# Altium schematic sheet ECUs.SchDoc
size A4; SheetNumber: 2; SheetTotal: 5
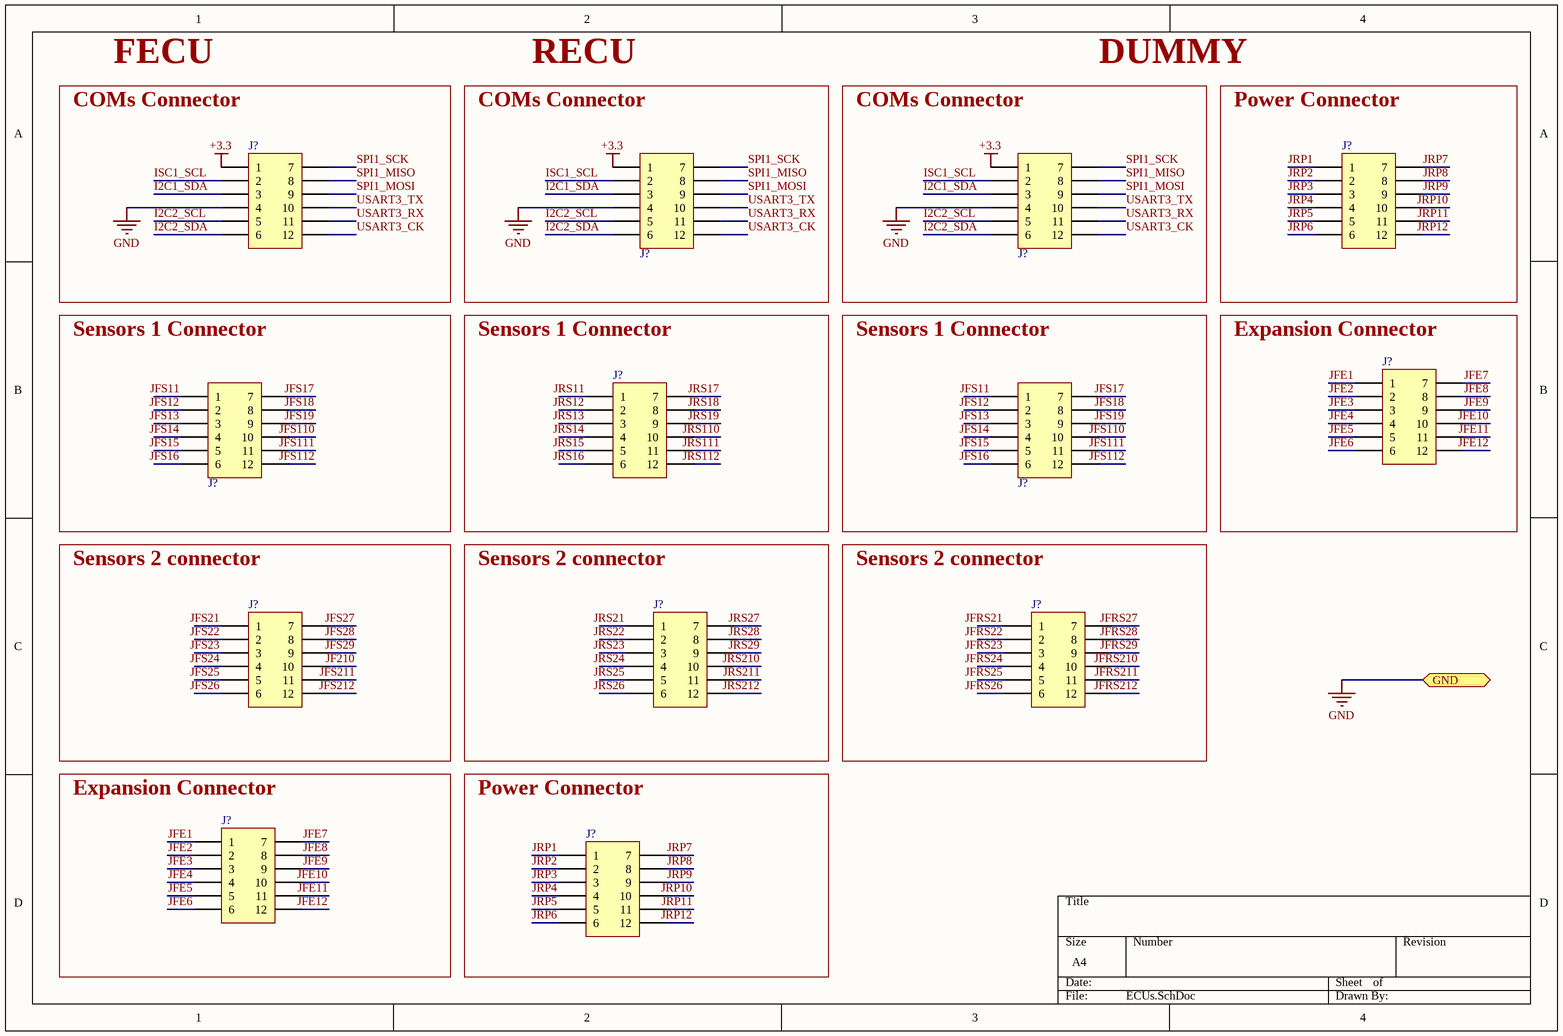
[diagram p0: ECUs.SchDoc]

## Parts
(Parts that share a designator on the sheet are numbered #1, #2 ... from top to bottom, then left to right.)
J?#1  1053101112  [J_NanoFit_2x6_V]  (value not drawn)
J?#2  1053101112  [J_NanoFit_2x6_V]  (value not drawn)
J?#3  1053101112  [J_NanoFit_2x6_V]  (value not drawn)
J?#4  1053101112  [J_NanoFit_2x6_V]  (value not drawn)
J?#5  1053101112  [J_NanoFit_2x6_V]  (value not drawn)
J?#6  1053101112  [J_NanoFit_2x6_V]  (value not drawn)
J?#7  1053101112  [J_NanoFit_2x6_V]  (value not drawn)
J?#8  1053101112  [J_NanoFit_2x6_V]  (value not drawn)
J?#9  1053101112  [J_NanoFit_2x6_V]  (value not drawn)
J?#10  1053101112  [J_NanoFit_2x6_V]  (value not drawn)
J?#11  1053101112  [J_NanoFit_2x6_V]  (value not drawn)
J?#12  1053101112  [J_NanoFit_2x6_V]  (value not drawn)
J?#13  1053101112  [J_NanoFit_2x6_V]  (value not drawn)

## Blocks framed on the sheet
FECU: J?#1
RECU: J?#2
DUMMY: J?#3
Power Connector: J?#4
Sensors 1 Connector: J?#6
Sensors 1 Connector: J?#7
Sensors 1 Connector: J?#8
Expansion Connector: J?#5
Sensors 2 connector: J?#9
Sensors 2 connector: J?#10
Sensors 2 connector: J?#11
Expansion Connector: J?#12
Power Connector: J?#13

## Ports
GND (bidir)

## Nets
+3.3: J?#1.1 J?#2.1 J?#3.1
GND: J?#1.4 J?#2.4 J?#3.4 ; port GND
I2C1_SDA: J?#1.3 J?#2.3 J?#3.3
I2C2_SCL: J?#1.5 J?#2.5 J?#3.5
I2C2_SDA: J?#1.6 J?#2.6 J?#3.6
ISC1_SCL: J?#1.2 J?#2.2 J?#3.2
JF210: J?#9.10
JFE1: J?#5.1 J?#12.1
JFE2: J?#5.2 J?#12.2
JFE3: J?#5.3 J?#12.3
JFE4: J?#5.4 J?#12.4
JFE5: J?#5.5 J?#12.5
JFE6: J?#5.6 J?#12.6
JFE7: J?#5.7 J?#12.7
JFE8: J?#5.8 J?#12.8
JFE9: J?#5.9 J?#12.9
JFE10: J?#5.10 J?#12.10
JFE11: J?#5.11 J?#12.11
JFE12: J?#5.12 J?#12.12
JFRS21: J?#11.1
JFRS22: J?#11.2
JFRS23: J?#11.3
JFRS24: J?#11.4
JFRS25: J?#11.5
JFRS26: J?#11.6
JFRS27: J?#11.7
JFRS28: J?#11.8
JFRS29: J?#11.9
JFRS210: J?#11.10
JFRS211: J?#11.11
JFRS212: J?#11.12
JFS11: J?#6.1 J?#8.1
JFS12: J?#6.2 J?#8.2
JFS13: J?#6.3 J?#8.3
JFS14: J?#6.4 J?#8.4
JFS15: J?#6.5 J?#8.5
JFS16: J?#6.6 J?#8.6
JFS17: J?#6.7 J?#8.7
JFS18: J?#6.8 J?#8.8
JFS19: J?#6.9 J?#8.9
JFS21: J?#9.1
JFS22: J?#9.2
JFS23: J?#9.3
JFS24: J?#9.4
JFS25: J?#9.5
JFS26: J?#9.6
JFS27: J?#9.7
JFS28: J?#9.8
JFS29: J?#9.9
JFS110: J?#6.10 J?#8.10
JFS111: J?#6.11 J?#8.11
JFS112: J?#6.12 J?#8.12
JFS211: J?#9.11
JFS212: J?#9.12
JRP1: J?#4.1 J?#13.1
JRP2: J?#4.2 J?#13.2
JRP3: J?#4.3 J?#13.3
JRP4: J?#4.4 J?#13.4
JRP5: J?#4.5 J?#13.5
JRP6: J?#4.6 J?#13.6
JRP7: J?#4.7 J?#13.7
JRP8: J?#4.8 J?#13.8
JRP9: J?#4.9 J?#13.9
JRP10: J?#4.10 J?#13.10
JRP11: J?#4.11 J?#13.11
JRP12: J?#4.12 J?#13.12
JRS11: J?#7.1
JRS12: J?#7.2
JRS13: J?#7.3
JRS14: J?#7.4
JRS15: J?#7.5
JRS16: J?#7.6
JRS17: J?#7.7
JRS18: J?#7.8
JRS19: J?#7.9
JRS21: J?#10.1
JRS22: J?#10.2
JRS23: J?#10.3
JRS24: J?#10.4
JRS25: J?#10.5
JRS26: J?#10.6
JRS27: J?#10.7
JRS28: J?#10.8
JRS29: J?#10.9
JRS110: J?#7.10
JRS111: J?#7.11
JRS112: J?#7.12
JRS210: J?#10.10
JRS211: J?#10.11
JRS212: J?#10.12
SPI1_MISO: J?#1.8 J?#2.8 J?#3.8
SPI1_MOSI: J?#1.9 J?#2.9 J?#3.9
SPI1_SCK: J?#1.7 J?#2.7 J?#3.7
USART3_CK: J?#1.12 J?#2.12 J?#3.12
USART3_RX: J?#1.11 J?#2.11 J?#3.11
USART3_TX: J?#1.10 J?#2.10 J?#3.10

## Notes on the sheet
- COMs Connector

## Library data of the parts
J?#1-J?#13 = J_NanoFit_2x6_V: Nano-Fit Vertical Header, Through Hole, 2.50mm Pitch, Dual Row, 12 Circuits, with Kinked Pins, Tin (Sn) Plating, Black, Glow-Wire Capable, Tray